# Altium schematic sheet ir-kh.SchDoc
size A3; SPICEModelCacheRLVYLVLF: <root> / <DocumentId>RLVYLVLF</DocumentId> / <CacheFrame Number="0"> / <Model Name="qnpn" Kind="MDL"> / <Text>*QNPN / *NPN Trans Pinout: C,B,E / .MODEL QNPN NPN(IS=3.2E-16 BF=141 VAF=35 ISE=2.6 NE=1.46 CJE=1E-13 / + MJE=0.333 TF=6E-11 CJC=1E-13 CJS=2.2E-13 MJS=0.5 FC=0.67 )</Text> / </Model> / <Model Name="dtunnel1" Kind="CKT"> / <Text>*Tunnel Diode Default / *MCE 600V 50A 27.2ns default parameters / *Diode Pinout: A,K / * Parameters: / * RS:  Series resistance value / * RP:  Negative resistance value in parallel with capacitance. / * CP:   Capacitance value in parallel with negative resistance. / * LS:  Series inductance value. / * / * / .SUBCKT DTUNNEL1 1 2 PARAMS: Rs=6 Rp=-75 Cp=0.6E-12 Ls=0.1nH / RS  1 3  {Rs} / RP  3 4  {Rp} / CP  3 4  {Cp} / LS  4 2  {Ls} / .ENDS DTUNNEL1</Text> / </Model> / </CacheFrame> / </root>
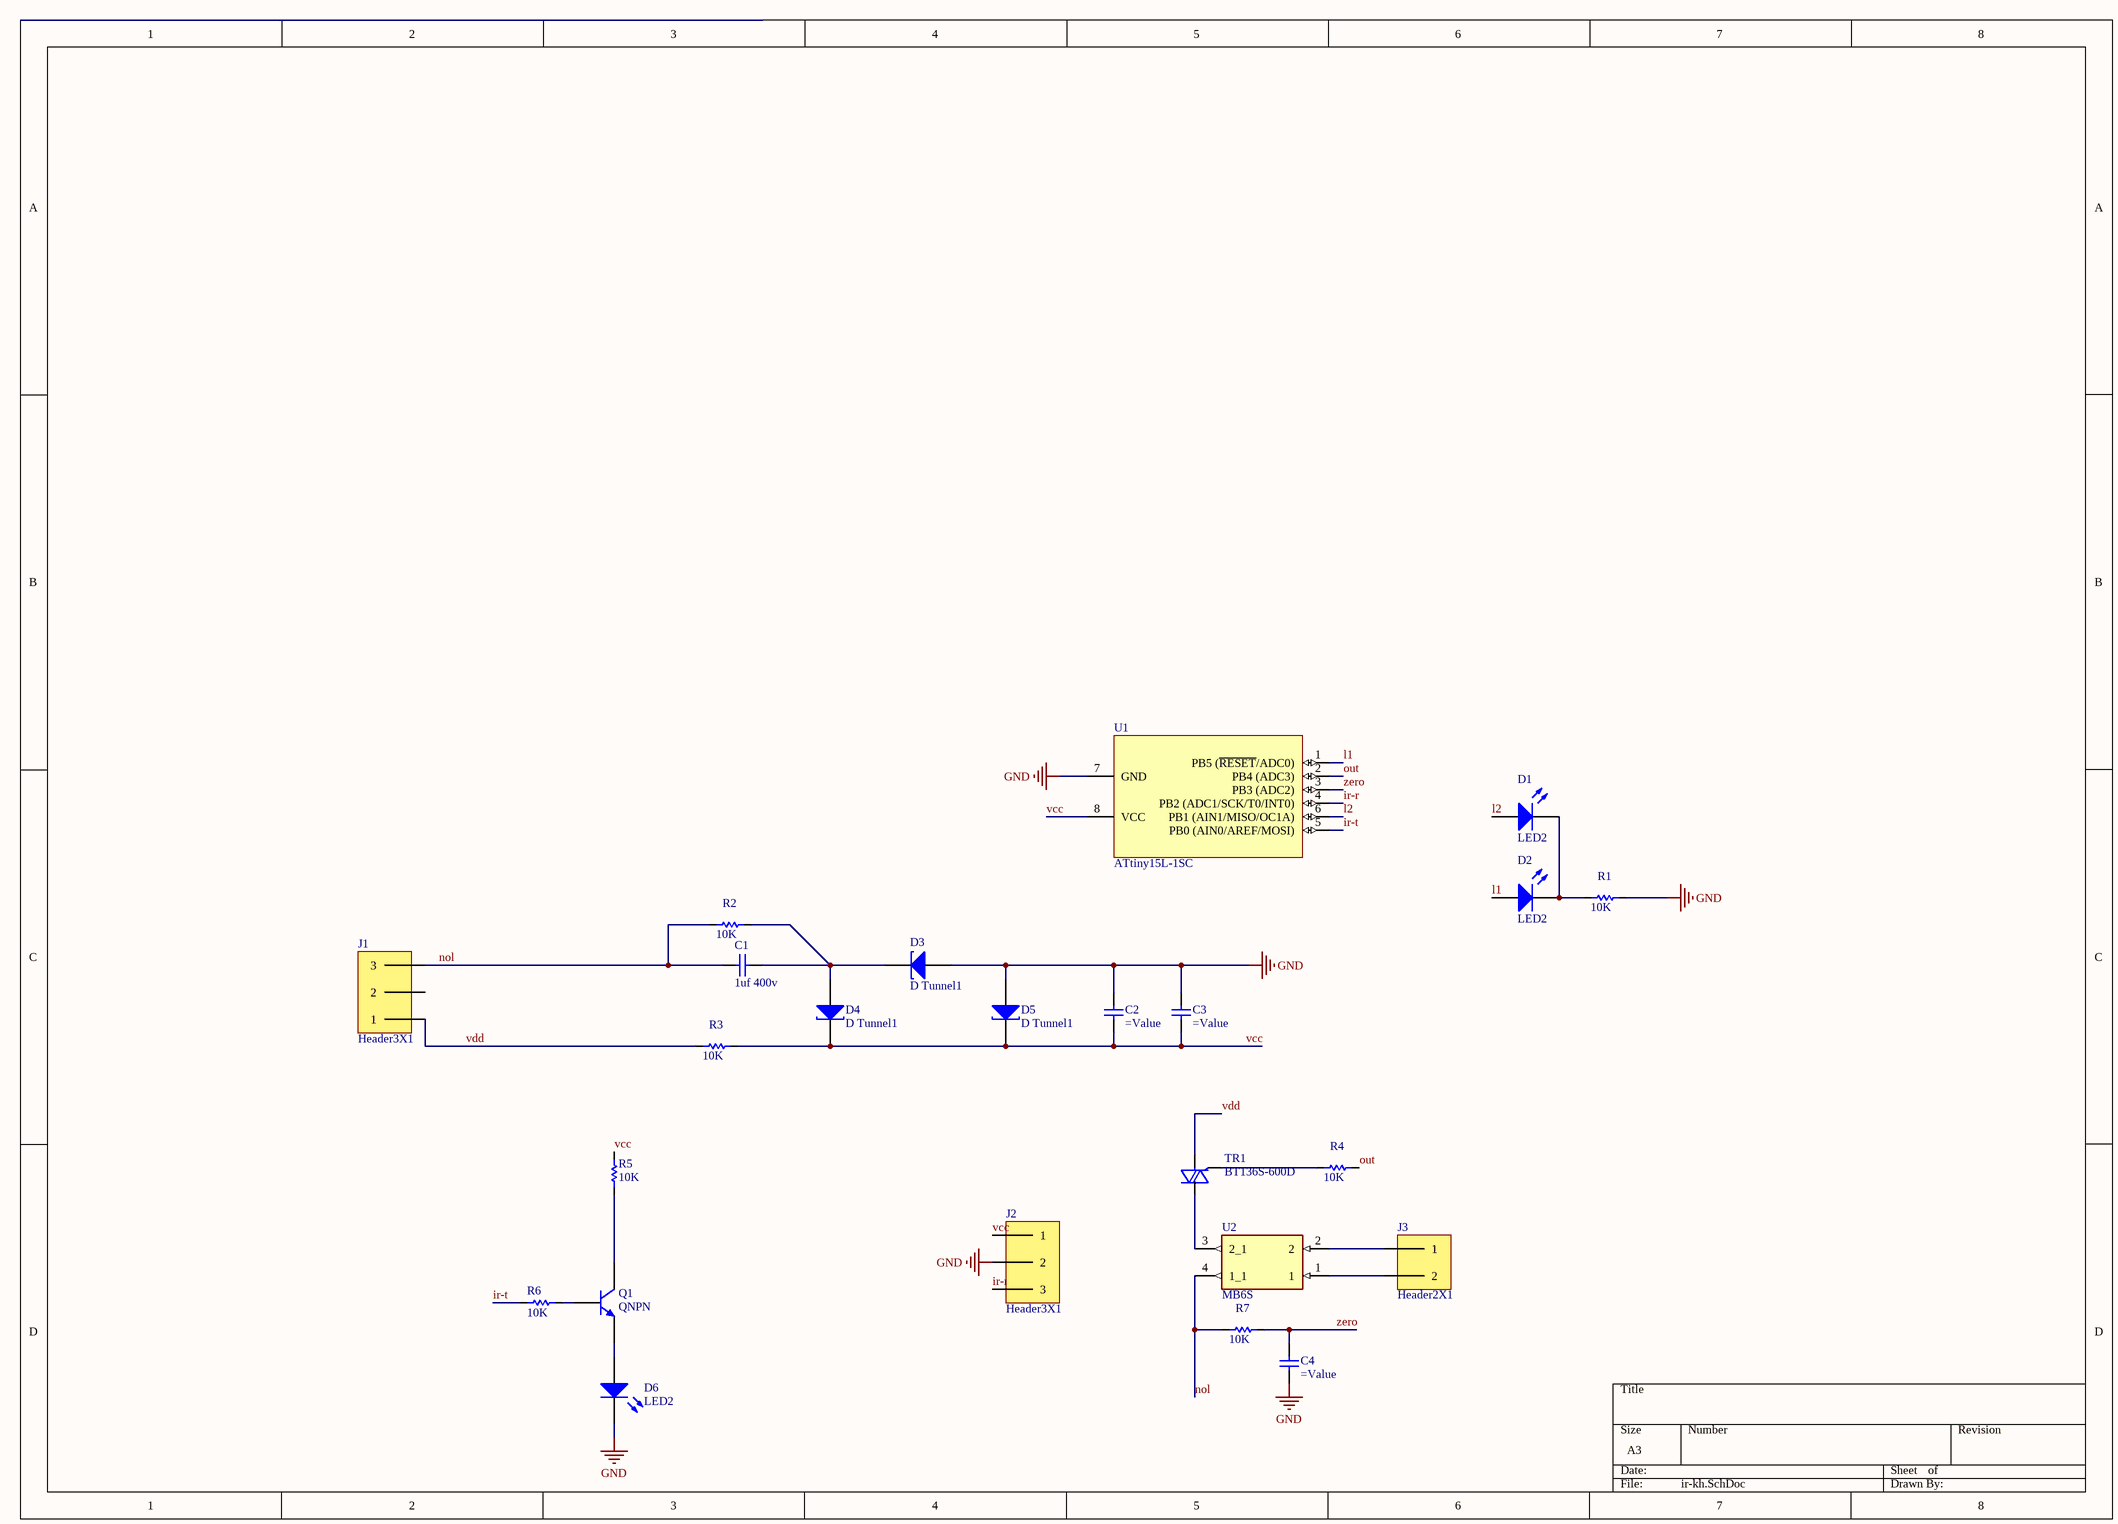
[diagram p0: ir-kh.SchDoc]

## Parts
C1  1uf 400v  [1uf 400v]
C2  (no value)  [CAP 1206]
C3  (no value)  [CAP 1206]
C4  (no value)  [CAP 1206]
D1  LED2  [3.2X1.6X1.1]
D2  LED2  [3.2X1.6X1.1]
D3  D Tunnel1  [3.2X1.6X1.1]
D4  D Tunnel1  [3.2X1.6X1.1]
D5  D Tunnel1  [3.2X1.6X1.1]
D6  LED2  [3.2X1.6X1.1]
J1  Header3X1  [HEADER 3X1]
J2  Header3X1  [HEADER 3X1]
J3  Header2X1  [Header 2X1]
Q1  QNPN  [SOT-23B_L]
R1  10K  [RES 1206 (3216X08L)]
R2  10K  [RES 1206 (3216X08L)]
R3  10K  [Res-(2/1)]
R4  10K  [RES 1206 (3216X08L)]
R5  10K  [RES 1206 (3216X08L)]
R6  10K  [RES 1206 (3216X08L)]
R7  10K  [RES 1206 (3216X08L)]
TR1  BT136S-600D  [SOT428]
U1  ATtiny15L-1SC  [8S2_N]
U2  MB6S  [SOIC245P670X270-4N]

## Nets
GND: C2.2(-) C3.2(-) C4.1(+) D3.1(A) D5.1(A) D6.2(K) J2.2 R1.2 U1.7(GND)
ir-r: J2.3 U1.4(PB2_(ADC1/SCK/T0/INT0))
ir-t: R6.1 U1.5(PB0_(AIN0/AREF/MOSI))
l1: D2.1(A) U1.1(PB5_(~{RESET}/ADC0))
l2: D1.1(A) U1.6(PB1_(AIN1/MISO/OC1A))
nol: C1.1 J1.3 R2.1 R7.1 U2.4(1_1)
out: R4.2 U1.2(PB4_(ADC3))
vcc: C2.1(+) C3.1(+) D4.2(K) D5.2(K) J2.1 R3.2 R5.2 U1.8(VCC)
vdd: J1.1 R3.1 TR1.1(A1)
zero: C4.2(-) R7.2 U1.3(PB3_(ADC2))
NetC1_2: C1.2 D3.2(K) D4.1(A) R2.2
NetD1_2: D1.2(K) D2.2(K) R1.1
NetD6_1: D6.1(A) Q1.3(E)
NetJ3_1: J3.1 U2.2
NetJ3_2: J3.2 U2.1
NetQ1_1: Q1.1(C) R5.1
NetQ1_2: Q1.2(B) R6.2
NetR4_1: R4.1 TR1.3(G)
NetTR1_MB: TR1.MB(A2) U2.3(2_1)

Not connected (* = marked no-connect by the designer): J1 2

## Library data of the parts
C1 = 1uf 400v: Capacitor 24*9mm; Designer: Seyed Mohsen Ghasemain; Value: 1uF; ComponentLinkURL: www.picpars.com
C2-C4 = Capacitor
D1 D2 D6 = LED2: Typical RED, GREEN, YELLOW, AMBER GaAs LED; Published: 8-Jun-2000; LatestRevisionDate: 17-Jul-2002; LatestRevisionNote: Re-released for DXP Platform.; PackageVersion: Feb-2002; PackageReference: 3.2X1.6X1.1; Publisher: Altium Limited; PackageDescription: SM LED; 2 Flat Leads
D3-D5 = D Tunnel1: Tunnel Diode - RLC Model; Published: 8-Jun-2000; LatestRevisionDate: 17-Jul-2002; LatestRevisionNote: Re-released for DXP Platform.; PackageVersion: Feb-2002; PackageReference: 3.2X1.6X1.1; Publisher: Altium Limited; PackageDescription: SM LED; 2 Flat Leads
Q1 = QNPN: NPN Bipolar Transistor; pin to pad: 1>3 2>1 3>2; Published: 8-Jun-2000; LatestRevisionDate: 29-May-2009; LatestRevisionNote: IPC-7351 Footprint Added.; PackageVersion: Aug-1999; PackageReference: SOT-23B; Publisher: Altium Limited; PackageDescription: 3-Pin SOT-23 Package 0.95 mm Pitch, 2.4 mm Lead Span
R1-R7 = Resistor: Tolerance: 5%; Power: 1/4 W; Value: 10K
TR1 = BT136S-600D: TRIAC 600V 27A 3-Pin(2+Tab) DPAK; MF: WeEn Semiconductor(Hong Kong)Co.,Limited; SnapEDA_Link: https://www.snapeda.com/parts/BT136S-600D/BitFenix+Co.+Ltd./view-part/?ref=snap; Package: None; Value: *; MP: BT136S-600D; Check_prices: https://www.snapeda.com/parts/BT136S-600D/BitFenix+Co.+Ltd./view-part/?ref=eda
U1 = ATtiny15L-1SC: 8-Bit AVR Microcontroller with 1K Byte of Flash Memory; pin to pad: 1>7 7>8 8>1; Published: 17-Sep-2003; LatestRevisionDate: 16-Oct-2006; LatestRevisionNote: IPC-7351 Footprint Added.; DatasheetVersion: 1187E-AVR-06/02; PackageVersion: revF, Apr-2008; PackageReference: 8S2; Publisher: Altium Limited; PackageDescription: 8-Lead, 0.208" Body, Plastic Small Outline Package (EIAJ); Supplier 1: Digi-Key; Supplier Part Number 1: ATTINY15L-1SC-ND; Supplier 2: Mouser; Supplier Part Number 2: 556-ATTINY15L1SC; ComponentLink1Description: Datasheet; ComponentLink1URL: http://www.atmel.com/dyn/resources/prod_documents/doc1187.pdf; ComponentLink2Description: Atmel.com Home; ComponentLink2URL: http://www.atmel.com
U2 = MB6S: Bridge Rectifier Single Phase Standard 600V Surface Mount 4-SOIC; MF: ON Semiconductor; Digi-Key_Purchase_URL: https://www.digikey.com.tr/product-detail/en/on-semiconductor/MB6S/MB6SCT-ND/965654?utm_source=snapeda&utm_medium=aggregator&utm_campaign=symbol; Value: *; Package: BESOP-4 Surge Components; Digi-Key_Part_Number: MB6SCT-ND; SnapEDA_Link: https://www.snapeda.com/parts/MB6S/ON%20Semiconductor/view-part/2774209/?ref=snap; MP: MB6S